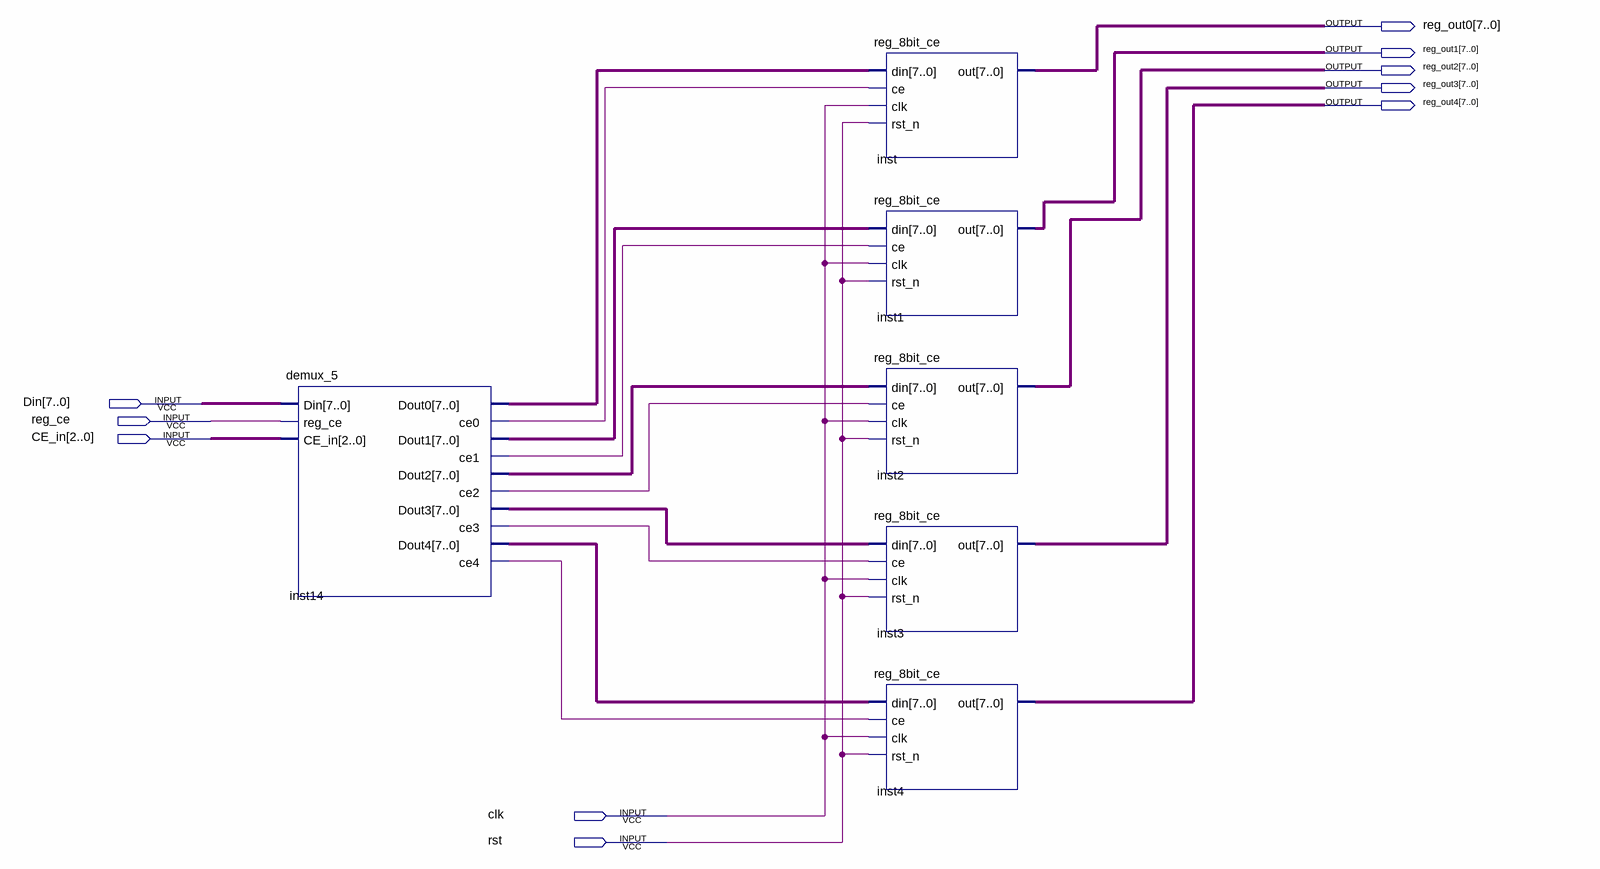
[diagram p0: schematic sheet]
// Quartus schematic RAM_5.bdf as structural Verilog: 6 symbols, 10 pins
module RAM_5 (
  input  [7:0] Din,
  input  reg_ce,
  input  [2:0] CE_in,
  input  clk,
  input  rst,
  output [7:0] reg_out0,
  output [7:0] reg_out1,
  output [7:0] reg_out2,
  output [7:0] reg_out3,
  output [7:0] reg_out4
);

  wire inst14_ce0, inst14_ce1, inst14_ce2, inst14_ce3, inst14_ce4;
  wire [7:0] inst14_dout0, inst14_dout1, inst14_dout2, inst14_dout3, inst14_dout4;

  demux_5 inst14 (
    .Din(Din), .reg_ce(reg_ce), .CE_in(CE_in), .Dout0(inst14_dout0), .ce0(inst14_ce0), .Dout1(inst14_dout1),
    .ce1(inst14_ce1), .Dout2(inst14_dout2), .ce2(inst14_ce2), .Dout3(inst14_dout3), .ce3(inst14_ce3),
    .Dout4(inst14_dout4), .ce4(inst14_ce4));
  reg_8bit_ce inst (.din(inst14_dout0), .ce(inst14_ce0), .clk(clk), .rst_n(rst), .out(reg_out0));
  reg_8bit_ce inst1 (.din(inst14_dout1), .ce(inst14_ce1), .clk(clk), .rst_n(rst), .out(reg_out1));
  reg_8bit_ce inst2 (.din(inst14_dout2), .ce(inst14_ce2), .clk(clk), .rst_n(rst), .out(reg_out2));
  reg_8bit_ce inst3 (.din(inst14_dout3), .ce(inst14_ce3), .clk(clk), .rst_n(rst), .out(reg_out3));
  reg_8bit_ce inst4 (.din(inst14_dout4), .ce(inst14_ce4), .clk(clk), .rst_n(rst), .out(reg_out4));
endmodule
